# EAGLE design untitled (EAGLE 9.5.1)
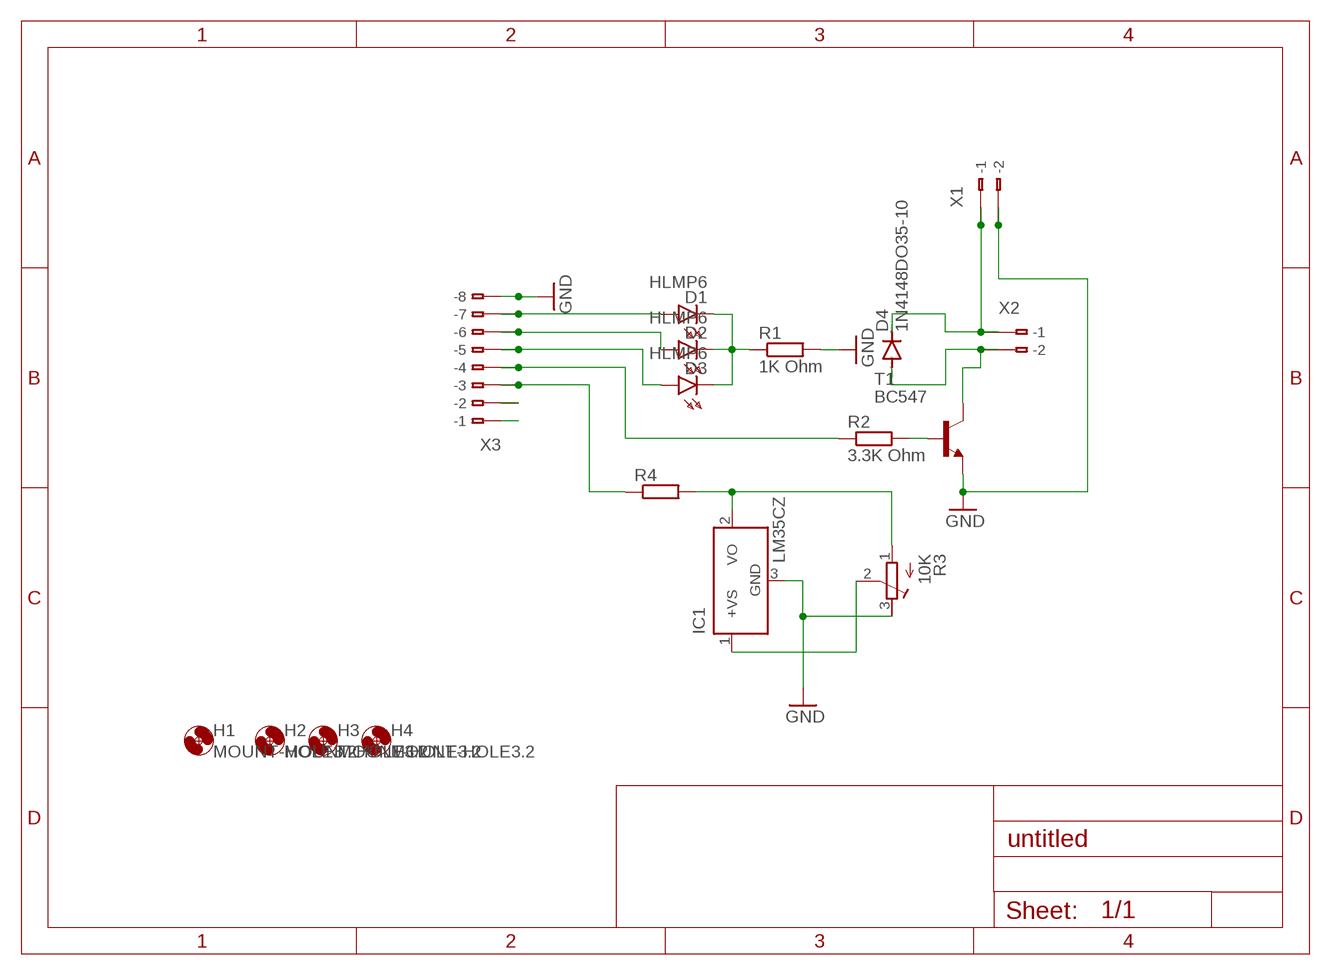
[diagram p0: schematic, sheet 1]

## Parts
D1  HLMP6  [HLMP6]
D2  HLMP6  [HLMP6]
D3  HLMP6  [HLMP6]
D4  1N4148DO35-10  [DO35-10]
H1  MOUNT-HOLE3.2  [3,2]
H2  MOUNT-HOLE3.2  [3,2]
H3  MOUNT-HOLE3.2  [3,2]
H4  MOUNT-HOLE3.2  [3,2]
IC1  LM35CZ  [TO92]
R1  1K Ohm  R-EU_0411/15  [0411/15]
R2  3.3K Ohm  R-EU_0411/15  [0411/15]
R3  10K  R-TRIMM3296X  [RTRIM3296X]
R4  R-EU_0411/15  [0411/15]
T1  BC547  [TO92]
X1  233-102  [233-102]
X2  233-102  [233-102]
X3  233-108  [233-108]

## Nets
GND: IC1.3(GND) R1.2 R3.3(E) T1.1(E) X1.A2(-2) X1.B2(B-2) X3.A8(-8) X3.B8(B-8)
N$1: IC1.1(+VS) R3.2(S)
N$2: D4.A T1.3(C) X2.A2(-2) X2.B2(B-2)
N$3: D1.A X3.A7(-7) X3.B7(B-7)
N$4: R2.2 T1.2(B)
N$5: R2.1 X3.A4(-4) X3.B4(B-4)
N$6: D1.K D2.K D3.K R1.1
N$7: D2.A X3.A6(-6) X3.B6(B-6)
N$8: D3.A X3.A5(-5) X3.B5(B-5)
N$9: D4.C X1.A1(-1) X1.B1(B-1) X2.A1(-1) X2.B1(B-1)
N$10: IC1.2(VO) R3.1(A) R4.2
N$11: X3.A2(-2) X3.B2(B-2)
N$12: R4.1 X3.A3(-3) X3.B3(B-3)
N$13: X3.A1(-1) X3.B1(B-1)

## Library data of the parts
D1-D3 = display-hp:HLMP6: LED 2mm horizontal; MF: AGILENT TECHNOLOGIES; MPN: HLMP-6500; OC_FARNELL: 1652490; OC_NEWARK: 40K0088
D4 = diode:1N4148: DIODE high speed (Philips)
H1-H4 = holes:MOUNT-HOLE: MOUNTING HOLE with drill center marker
IC1 = lm35:LM35: Single-Supply Centigrade Temperature Sensor Vout = (10mV/°C x Temp °C) +5mmmV Source: http://www.national.com/ds/LM/LM35.pdf
R1 R2 R4 = rcl:R-EU_: RESISTOR, European symbol; SPICEPREFIX: R
R3 = rcl:R-TRIMM: Trimm resistor; SPICEMODEL: X; SPICEPREFIXL: POT
T1 = transistor:BC547: NPN TRANSISTOR
X1 X2 = con-wago:233-102: WAGO Cage Clamp; MPN: 233-102; OC_FARNELL: unknown; OC_NEWARK: 28K9044
X3 = con-wago:233-108: WAGO Cage Clamp; MPN: 233-108; OC_FARNELL: unknown; OC_NEWARK: 28K9050

## Board
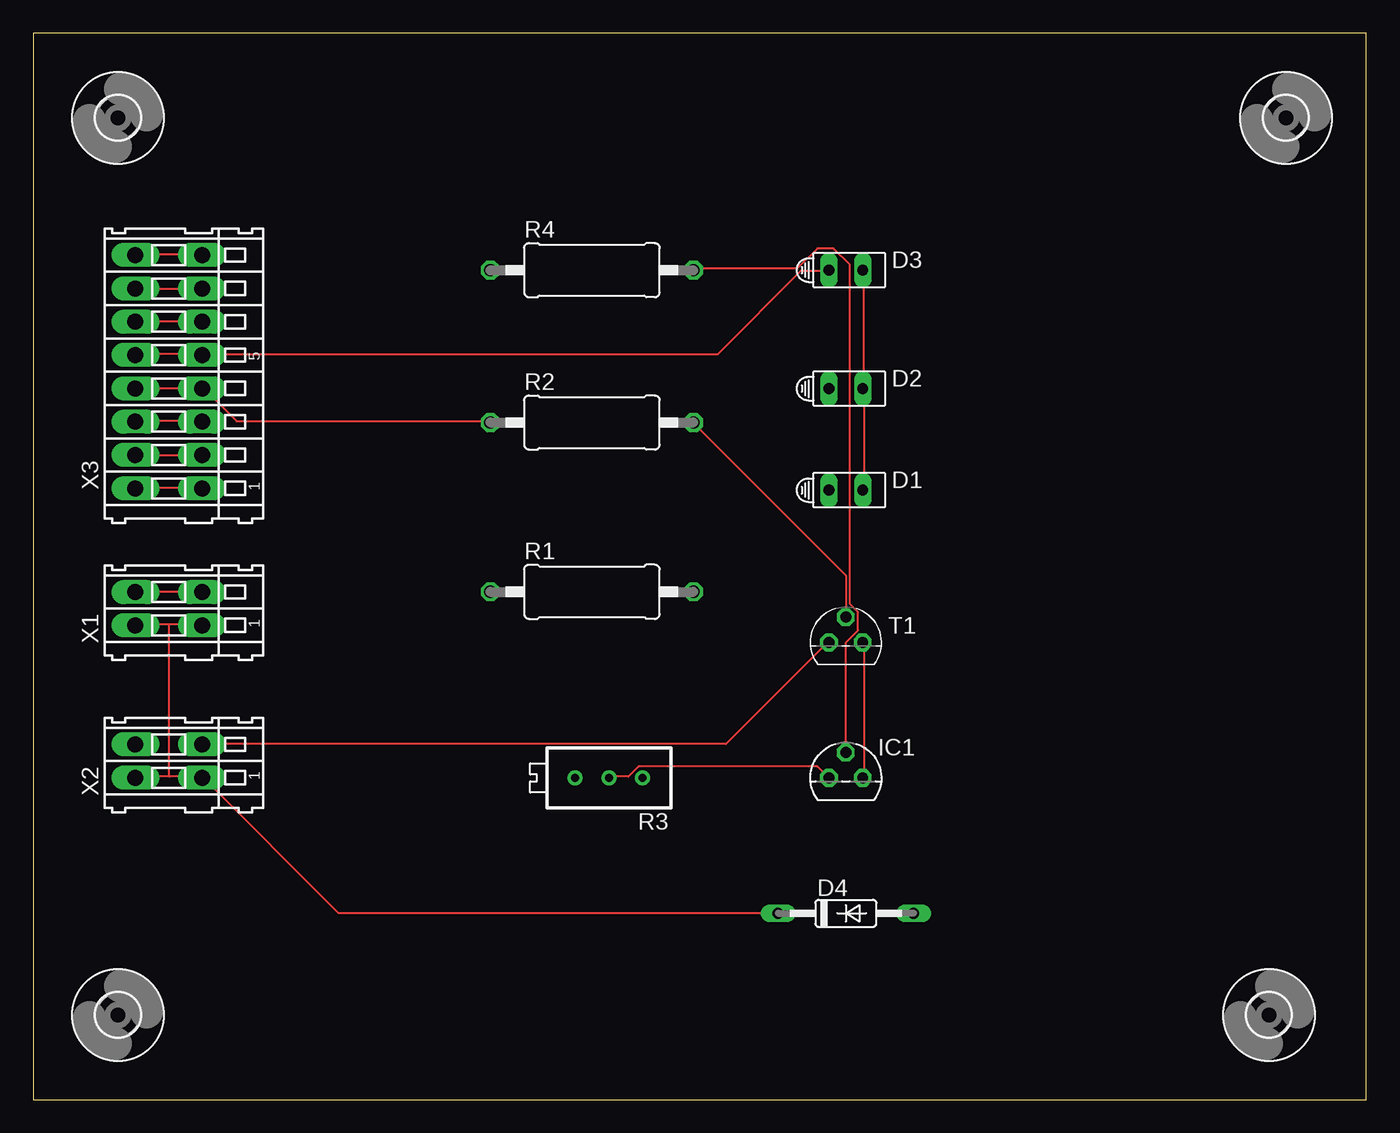
[diagram p1: board, top side]
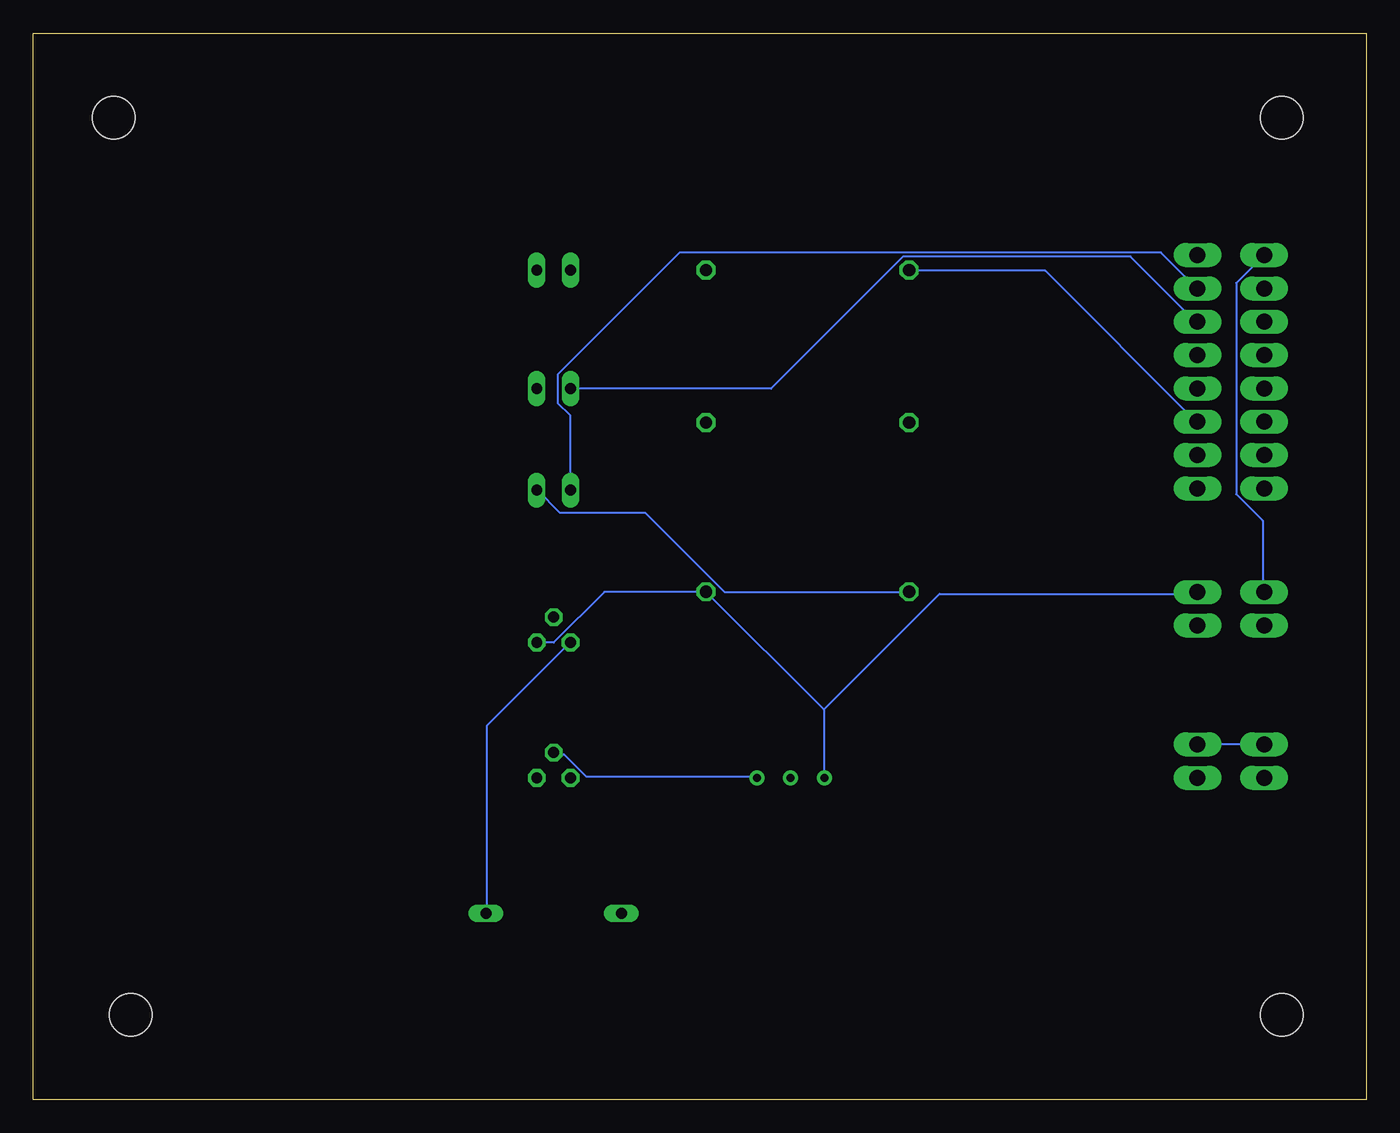
[diagram p2: board, bottom side, seen from below]

Size 100 x 80 mm. Coordinates in mm from the lower left corner, seen from the top.
Outline: 0,0 100,0 100,80 0,80 0,0
Copper layers (1*16): Top 0.035mm / dielectric 1.5mm / Bottom 0.035mm
Design rules "default": minimum track width 6mil, minimum drill 0.35mm, track to track 6mil, track to pad 6mil, pad to pad 6mil, via to via 6mil, smd to smd 6mil, copper to edge 40mil, drill to drill 6mil, minimum pad ring 10mil, minimum via ring 8mil, stop-mask expansion 4mil, vias tented up to drill 0mil, thermal gap 10mil

### Footprints (pad centres in the part's own frame; a part is rotated, then mirrored left to right if it is on the bottom)
HLMP6 = drill 0.813 long: A -1.27,0; K 1.27,0
DO35-10 = drill 0.813 long: A 5.08,0; C -5.08,0
3,2 = hole 3.2: 0,0
TO92 = drill 0.813 octagon: 1 -1.27,0; 2 0,1.905; 3 1.27,0
0411/15 = drill 0.914 octagon: 1 -7.62,0; 2 7.62,0
RTRIM3296X = drill 0.61: 1 0,-2.54; 2 0,0; 3 0,2.54
TO92' = drill 0.813 octagon: 1 1.27,0; 2 0,1.905; 3 -1.27,0
233-102 = drill 1.2 long: A1 -1.25,2.5; A2 1.25,2.5; B1 -1.25,-2.5; B2 1.25,-2.5
233-108 = drill 1.2 long: A1 -8.75,2.5; A2 -6.25,2.5; A3 -3.75,2.5; A4 -1.25,2.5; A5 1.25,2.5; A6 3.75,2.5; A7 6.25,2.5; A8 8.75,2.5; B1 -8.75,-2.5; B2 -6.25,-2.5; B3 -3.75,-2.5; B4 -1.25,-2.5; B5 1.25,-2.5; B6 3.75,-2.5; B7 6.25,-2.5; B8 8.75,-2.5

### Placement (x,y rotation side)
D1  60.96,45.72 0 top
D2  60.96,53.34 0 top
D3  60.96,62.23 0 top
D4  60.96,13.97 0 top
H1  6.35,73.66 0 top
H2  93.98,73.66 0 top
H3  92.71,6.35 0 top
H4  6.35,6.35 0 top
IC1  60.96,24.13 0 top
R1  41.91,38.1 0 top
R2  41.91,50.8 0 top
R3  43.18,24.13 90 top
R4  41.91,62.23 0 top
T1  BC547  [TO92']  60.96,34.29 0 top
X1  10.16,36.83 90 top
X2  10.16,25.4 90 top
X3  10.16,54.61 90 top

### Tracks (layer width: path | path; a pad name or v marks a point on that pad's centre or on a via)
GND
  Top 0.152: X1.A2 7.77,38.1 12.65,38.1 X1.B2 | X3.A8 7.77,63.4 12.65,63.4 X3.B8 | IC1.3 62.33,24.23 62.33,34.29 T1.1
  Bottom 0.152: X1.A2 7.77,38.1 7.77,43.43 9.75,45.41 9.75,61.27 7.77,63.25 X3.A8 | 40.69,29.26 40.69,24.23 R3.3 | 40.69,29.26 R1.2 57.15,38.1 60.96,34.29 T1.1 | 40.69,29.26 32,37.95 12.8,37.95 X1.B2
N$1
  Top 0.152: IC1.1 58.83,24.99 45.41,24.99 44.65,24.23 43.28,24.23 R3.2
N$2
  Top 0.152: X2.B2 12.8,26.67 51.97,26.67 59.59,34.29 T1.3
  Bottom 0.152: X2.A2 7.77,26.67 12.65,26.67 X2.B2 | D4.A 65.99,14.02 65.99,28.04 59.74,34.29 T1.3
N$3
  Top 0.152: X3.A7 7.77,60.81 12.65,60.81 X3.B7
  Bottom 0.152: D1.A 59.74,45.72 59.74,51.36 60.66,52.27 60.66,54.41 51.51,63.55 15.39,63.55 12.8,60.96 X3.B7
N$4
  Top 0.152: T1.2 60.96,39.32 49.53,50.75 R2.2
N$5
  Top 0.152: R2.1 34.29,50.9 15.24,50.9 12.8,53.34 X3.B4 12.65,53.34 7.77,53.34 X3.A4
N$6
  Top 0.152: 62.33,53.34 62.33,45.72 D1.K | 62.33,53.34 62.33,62.18 D3.K | 62.33,53.34 D2.K
  Bottom 0.152: R1.1 48.16,38.1 54.1,44.04 60.5,44.04 62.18,45.72 D1.K
N$7
  Top 0.152: X3.A6 7.77,58.37 12.65,58.37 X3.B6
  Bottom 0.152: D2.A 44.65,53.34 34.75,63.25 17.68,63.25 12.8,58.37 X3.B6
N$8
  Top 0.152: D3.A 59.59,62.18 57.61,62.18 51.36,55.93 12.8,55.93 X3.B5 12.65,55.93 7.77,55.93 X3.A5
N$9
  Top 0.152: 10.21,35.66 12.65,35.66 X1.B1 | 10.21,35.66 7.77,35.66 X1.A1 | D4.C 55.78,14.02 22.86,14.02 12.8,24.08 X2.B1 12.65,24.23 10.21,24.23 | 10.21,24.23 7.77,24.23 X2.A1 | 10.21,24.23 10.21,35.66
N$10
  Top 0.152: IC1.2 60.96,34.29 61.87,35.2 61.87,36.58 61.27,37.19 61.27,62.64 60.05,63.86 58.83,63.86 57.3,62.33 49.53,62.33 R4.2
  Bottom 0.152: R3.1 45.72,24.23 58.52,24.23 60.2,25.91 60.96,25.91 IC1.2
N$11
  Top 0.152: X3.A2 7.77,48.31 12.65,48.31 X3.B2
N$12
  Top 0.152: X3.A3 7.77,50.9 12.65,50.9 X3.B3
  Bottom 0.152: R4.1 34.29,62.18 24.08,62.18 12.8,50.9 X3.B3
N$13
  Top 0.152: X3.A1 7.77,45.87 12.65,45.87 X3.B1